# Altium schematic sheet UART.SchDoc
size A4
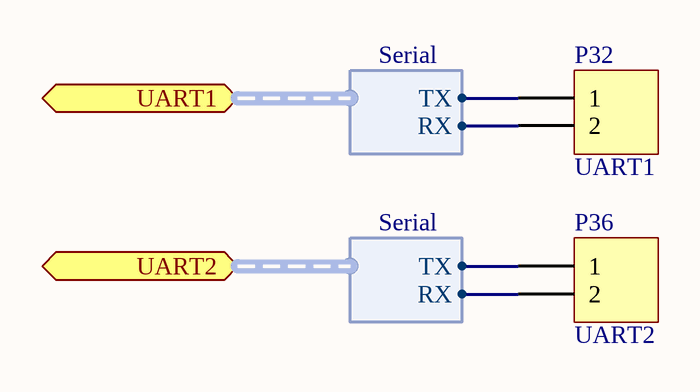
[diagram p0: UART.SchDoc]

## Parts
P32  UART1  [Headers - 1x2 - Vertical - Lock]
P36  UART2  [Headers - 1x2 - Vertical - Lock]

## Ports
UART1 (harness Serial), UART2 (harness Serial)

## Harnesses
Serial: TX, RX

## Nets
NetP32_1: P32.1 ; port UART1.TX
NetP32_2: P32.2 ; port UART1.RX
NetP36_1: P36.1 ; port UART2.TX
NetP36_2: P36.2 ; port UART2.RX

## Library data of the parts
P32 P36 = Header-0.100-Vertical-Lock-1X2: CONN HEADER 2POS .100" STR TIN; Manufacturer: Molex Inc; Manufacturer No: 0901361102; Sub Category: 100mils Vertical lock; Value: 2 pins; LatestRevisionDate: 17-Jul-2002; LatestRevisionNote: Re-released for DXP Platform.; Publisher: Altium Limited; Part Number: Header-0.100-Vertical-Lock-1X2; Category: Header; Pin count: 2; Series: C-Grid III 90136; Supplier 1: Digi-Key; Supplier Part Number 1: WM8213-ND; ComponentLink1URL: http://www.molex.com/pdm_docs/sd/901361102_sd.pdf; ComponentLink1Description: Datasheet; Creation Date: 2013-11-05 17:17:54; Created by: Pier-Yves; Height: 10.9mm